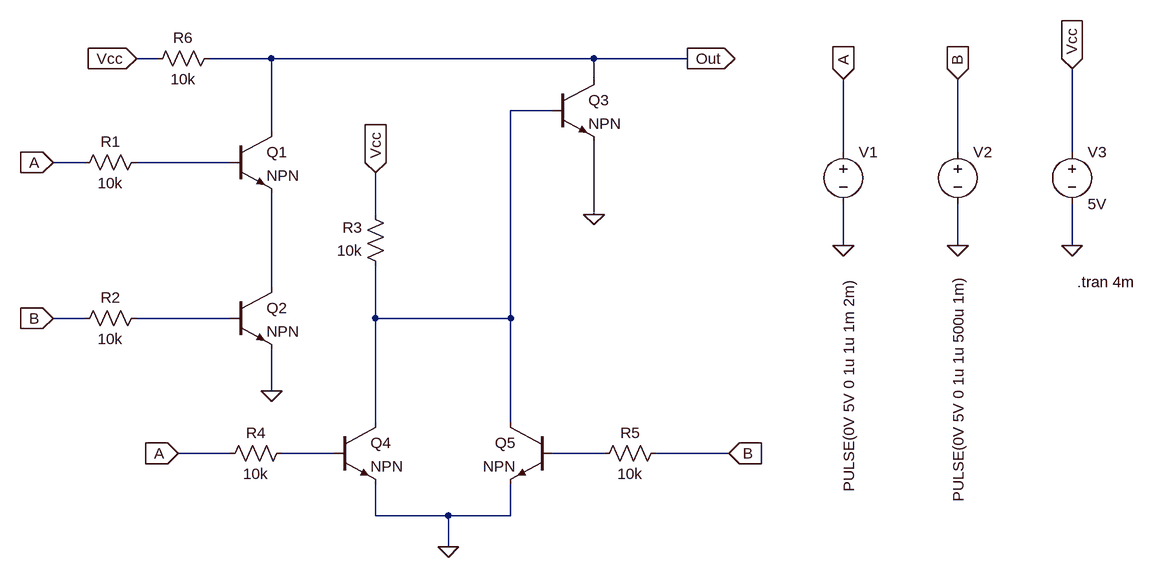
[diagram p0: schematic XORGate.asc]
XORGate.asc, the LTspice schematic file:
Version 4
SHEET 1 1848 1116
WIRE 176 -32 144 -32
WIRE 352 -32 256 -32
WIRE 848 -32 352 -32
WIRE 992 -32 848 -32
WIRE 848 0 848 -32
WIRE 784 48 720 48
WIRE 352 80 352 -32
WIRE 1232 112 1232 0
WIRE 1408 112 1408 0
WIRE 1584 112 1584 -16
WIRE 64 128 16 128
WIRE 288 128 144 128
WIRE 512 208 512 144
WIRE 848 208 848 96
WIRE 1232 256 1232 192
WIRE 1408 256 1408 192
WIRE 1584 256 1584 192
WIRE 352 320 352 176
WIRE 64 368 16 368
WIRE 288 368 144 368
WIRE 512 368 512 288
WIRE 720 368 720 48
WIRE 720 368 512 368
WIRE 352 480 352 416
WIRE 512 528 512 368
WIRE 720 528 720 368
WIRE 288 576 208 576
WIRE 448 576 368 576
WIRE 864 576 784 576
WIRE 1056 576 944 576
WIRE 512 672 512 624
WIRE 624 672 512 672
WIRE 720 672 720 624
WIRE 720 672 624 672
WIRE 624 720 624 672
FLAG 144 -32 Vcc
IOPIN 144 -32 In
FLAG 512 144 Vcc
IOPIN 512 144 In
FLAG 16 128 A
IOPIN 16 128 In
FLAG 16 368 B
IOPIN 16 368 In
FLAG 208 576 A
IOPIN 208 576 In
FLAG 1056 576 B
IOPIN 1056 576 In
FLAG 992 -32 Out
IOPIN 992 -32 Out
FLAG 624 720 0
FLAG 848 208 0
FLAG 352 480 0
FLAG 1232 256 0
FLAG 1408 256 0
FLAG 1584 256 0
FLAG 1232 0 A
IOPIN 1232 0 In
FLAG 1408 0 B
IOPIN 1408 0 In
FLAG 1584 -16 Vcc
IOPIN 1584 -16 In
SYMBOL npn 288 80 R0
SYMATTR InstName Q1
SYMBOL npn 288 320 R0
SYMATTR InstName Q2
SYMBOL npn 784 0 R0
SYMATTR InstName Q3
SYMBOL npn 448 528 R0
SYMATTR InstName Q4
SYMBOL npn 784 528 M0
SYMATTR InstName Q5
SYMBOL res 160 112 R90
WINDOW 0 0 56 VBottom 2
WINDOW 3 32 56 VTop 2
SYMATTR InstName R1
SYMATTR Value 10k
SYMBOL res 160 352 R90
WINDOW 0 0 56 VBottom 2
WINDOW 3 32 56 VTop 2
SYMATTR InstName R2
SYMATTR Value 10k
SYMBOL res 528 304 R180
WINDOW 0 36 76 Left 2
WINDOW 3 36 40 Left 2
SYMATTR InstName R3
SYMATTR Value 10k
SYMBOL res 272 592 R270
WINDOW 0 32 56 VTop 2
WINDOW 3 0 56 VBottom 2
SYMATTR InstName R4
SYMATTR Value 10k
SYMBOL res 848 592 R270
WINDOW 0 32 56 VTop 2
WINDOW 3 0 56 VBottom 2
SYMATTR InstName R5
SYMATTR Value 10k
SYMBOL res 160 -16 R270
WINDOW 0 32 56 VTop 2
WINDOW 3 0 56 VBottom 2
SYMATTR InstName R6
SYMATTR Value 10k
SYMBOL voltage 1232 96 R0
WINDOW 3 9 211 VRight 2
WINDOW 123 0 0 Left 0
WINDOW 39 0 0 Left 0
SYMATTR Value PULSE(0V 5V 0 1u 1u 1m 2m)
SYMATTR InstName V1
SYMBOL voltage 1408 96 R0
WINDOW 3 1 555 VLeft 2
WINDOW 123 0 0 Left 0
WINDOW 39 0 0 Left 0
SYMATTR Value PULSE(0V 5V 0 1u 1u 500u 1m)
SYMATTR InstName V2
SYMBOL voltage 1584 96 R0
WINDOW 123 0 0 Left 0
WINDOW 39 0 0 Left 0
SYMATTR InstName V3
SYMATTR Value 5V
TEXT 1592 312 Left 2 !.tran 4m

The netlist it stands for:
* XORGate.asc
Q1 Out N002 N003 0 NPN
Q2 N003 N004 0 0 NPN
Q3 Out N001 0 0 NPN
Q4 N001 N005 0 0 NPN
Q5 N001 N006 0 0 NPN
R1 N002 A 10k
R2 N004 B 10k
R3 N001 Vcc 10k
R4 A N005 10k
R5 N006 B 10k
R6 Vcc Out 10k
V1 A 0 PULSE(0V 5V 0 1u 1u 1m 2m)
V2 B 0 PULSE(0V 5V 0 1u 1u 500u 1m)
V3 Vcc 0 5V
.model NPN NPN
.model PNP PNP
.lib standard.bjt
.tran 4m
.backanno
.end